# EAGLE schematic ECG_TRUE (EAGLE 9.4.1)
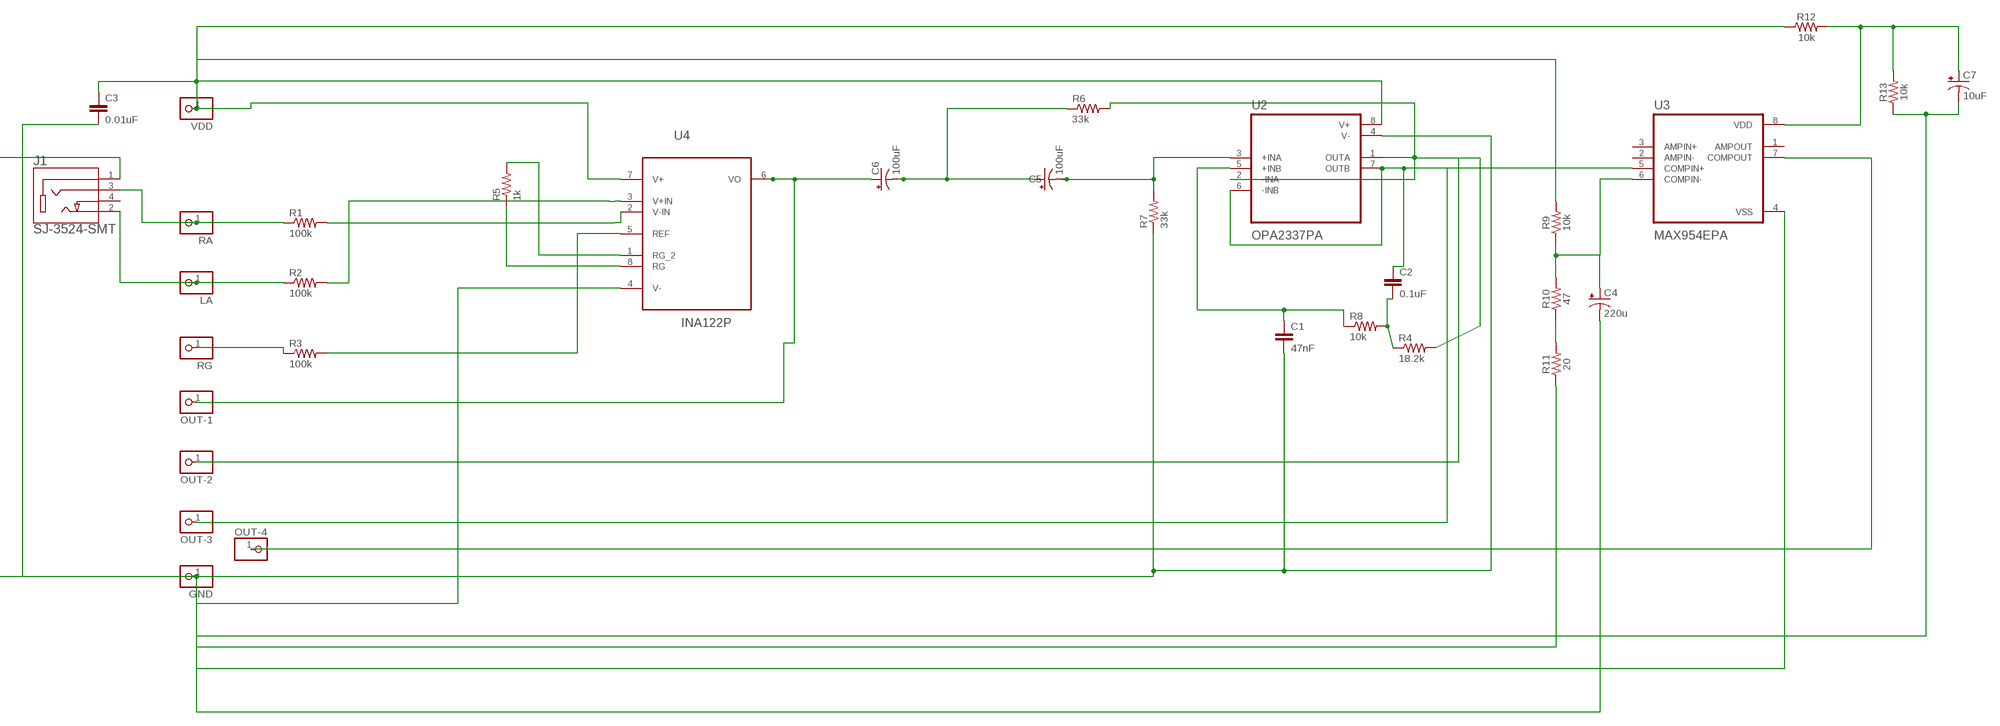
[diagram p0: schematic, sheet 1]

## Parts
C1  47nF  0.1UF-KIT-EZ-50V-20%  [CAP-PTH-SMALL-KIT]
C2  0.1uF  0.1UF-KIT-EZ-50V-20%  [CAP-PTH-SMALL-KIT]
C3  0.01uF  0.1UF-KIT-EZ-50V-20%  [CAP-PTH-SMALL-KIT]
C4  220u  CAPACITOR-PE3.5-10  [E3,5-10]
C5  100uF  100UF-POLAR-RADIAL-2.5MM-25V-20%  [CPOL-RADIAL-2.5MM-6.5MM]
C6  100uF  100UF-POLAR-RADIAL-2.5MM-25V-20%  [CPOL-RADIAL-2.5MM-6.5MM]
C7  10uF  10UF-POLAR-RADIAL-2.5MM-KIT-25V-20%  [CPOL-RADIAL-2.5MM-5MM-KIT]
GND  PINHD-1X1  [1X01]
J1  SJ-3524-SMT  [CUI_SJ-3524-SMT]
LA  PINHD-1X1  [1X01]
OUT-1  PINHD-1X1  [1X01]
OUT-2  PINHD-1X1  [1X01]
OUT-3  PINHD-1X1  [1X01]
OUT-4  PINHD-1X1  [1X01]
R1  100k  10KOHM-HORIZ_KIT-1/4W-1%  [AXIAL-0.3-KIT]
R2  100k  10KOHM-HORIZ_KIT-1/4W-1%  [AXIAL-0.3-KIT]
R3  100k  10KOHM-HORIZ_KIT-1/4W-1%  [AXIAL-0.3-KIT]
R4  18.2k  10KOHM-HORIZ_KIT-1/4W-1%  [AXIAL-0.3-KIT]
R5  1k  1KOHM-HORIZ_KIT-1/4W-1%  [AXIAL-0.3-KIT]
R6  33k  10KOHM-HORIZ_KIT-1/4W-1%  [AXIAL-0.3-KIT]
R7  33k  10KOHM-HORIZ_KIT-1/4W-1%  [AXIAL-0.3-KIT]
R8  10k  10KOHM-HORIZ_KIT-1/4W-1%  [AXIAL-0.3-KIT]
R9  10k  10KOHM-HORIZ_KIT-1/4W-1%  [AXIAL-0.3-KIT]
R10  47  10KOHM-HORIZ_KIT-1/4W-1%  [AXIAL-0.3-KIT]
R11  20  10KOHM-HORIZ_KIT-1/4W-1%  [AXIAL-0.3-KIT]
R12  10k  10KOHM-HORIZ-1/6W-5%  [AXIAL-0.3]
R13  10k  10KOHM-HORIZ-1/6W-5%  [AXIAL-0.3]
RA  PINHD-1X1  [1X01]
RG  PINHD-1X1  [1X01]
U2  OPA2337PA  [DIP794W45P254L1060H508Q8]
U3  MAX954EPA  [DIP794W47P254L991H457Q8]
U4  INA122P  [DIP254P762X508-8]
VDD  PINHD-1X1  [1X01]

## Nets
N$1: J1.3 R1.P$1 RA.1
N$2: C7.1(+) R12.P$2 R13.P$2 U3.8(VDD)
N$3: C2.2 R4.P$1 R8.P$2
N$4: R1.P$2 U4.2(V-IN)
N$6: R2.P$2 U4.3(V+IN)
N$7: R3.P$1 RG.1
N$8: R3.P$2 U4.5(REF)
N$9: C6.1(+) OUT-1.1 U4.6(VO)
N$10: R5.P$2 U4.1(RG_2)
N$11: R5.P$1 U4.8(RG)
N$12: C5.1(+) C6.2(-) R6.P$1
N$13: C5.2(-) R7.P$2 U2.3(+INA)
N$15: OUT-2.1 R4.P$2 R6.P$2 U2.1(OUTA) U2.2(-INA)
N$16: C3.1 R9.P$2 R12.P$1 U2.8(V+) U4.7(V+) VDD.1
N$17: C2.1 OUT-3.1 U2.6(-INB) U2.7(OUTB) U3.5(COMPIN+)
N$18: R10.P$1 R11.P$2
N$19: C1.1 R8.P$1 U2.5(+INB)
N$20: C4.+ R9.P$1 R10.P$2 U3.6(COMPIN-)
N$21: OUT-4.1 U3.7(COMPOUT)
N$22: J1.2 LA.1 R2.P$1
N$23: C1.2 C3.2 C4.- C7.2(-) GND.1 J1.1 R7.P$1 R11.P$1 R13.P$1 U2.4(V-) U3.4(VSS) U4.4(V-)
Unconnected: J1.4 U3.1(AMPOUT) U3.2(AMPIN-) U3.3(AMPIN+)

## Library data of the parts
C1 C3 = SparkFun-Capacitors:0.1UF: 0.1µF ceramic capacitors A capacitor is a passive two-terminal electrical component used to store electrical energy temporarily in an electric field.; PROD_ID: CAP-08370; VALUE: 0.1uF
C2 = SparkFun-Capacitors:0.1UF: 0.1µF ceramic capacitors A capacitor is a passive two-terminal electrical component used to store electrical energy temporarily in an electric field.; PROD_ID: CAP-08370
C4 = BeagleBone_Blue_R3:CAPACITOR-P: POLARIZED CAPACITOR, American symbol
C5 C6 = SparkFun-Capacitors:100UF-POLAR: 100µF polarized capacitors A capacitor is a passive two-terminal electrical component used to store electrical energy temporarily in an electric field.; PROD_ID: CAP-08439
C7 = SparkFun-Capacitors:10UF-POLAR: 10.0µF polarized capacitors A capacitor is a passive two-terminal electrical component used to store electrical energy temporarily in an electric field.; PROD_ID: CAP-08440
GND LA OUT-1-OUT-4 RA RG VDD = pinhead:PINHD-1X1: PIN HEADER
J1 = SJ-3524-SMT:SJ-3524-SMT: Audio Jack Connector 3.5 mm Low Profile Surface Mount Stereo Jack, 4 Pin Right-Angle; CUI_PURCHASE_URL: https://www.cui.com/product/interconnect/connectors/audio-connectors/jacks/sj-352x-smt-series?utm_source=snapeda.com&utm_medium=referral&utm_campaign=snapedaBOM; DESCRIPTION: 3.5 mm, Stereo, Right Angle, Surface Mount _SMT_, Audio Jack Connector; DIGI-KEY_PART_NUMBER: CP-3524SJCT-ND; DIGI-KEY_PURCHASE_URL: https://www.digikey.com/product-detail/en/cui-devices/SJ-3524-SMT-TR/CP-3524SJCT-ND/669705?utm_source=snapeda&utm_medium=aggregator&utm_campaign=symbol; MF: CUI Devices; MP: SJ-3524-SMT-TR; PACKAGE: None
R1-R4 R6 R7 R10 R11 = SparkFun-Resistors:10KOHM: 10kΩ resistor A resistor is a passive two-terminal electrical component that implements electrical resistance as a circuit element. Resistors act to reduce current flow, and, at the same time, act to lower voltage levels within circuits. - Wikipedia; PROD_ID: RES-12183; VALUE: 10k
R5 = SparkFun-Resistors:1KOHM: 1kΩ resistor A resistor is a passive two-terminal electrical component that implements electrical resistance as a circuit element. Resistors act to reduce current flow, and, at the same time, act to lower voltage levels within circuits. - Wikipedia; PROD_ID: RES-12182
R8 R9 = SparkFun-Resistors:10KOHM: 10kΩ resistor A resistor is a passive two-terminal electrical component that implements electrical resistance as a circuit element. Resistors act to reduce current flow, and, at the same time, act to lower voltage levels within circuits. - Wikipedia; PROD_ID: RES-12183
R12 R13 = SparkFun-Resistors:10KOHM: 10kΩ resistor A resistor is a passive two-terminal electrical component that implements electrical resistance as a circuit element. Resistors act to reduce current flow, and, at the same time, act to lower voltage levels within circuits. - Wikipedia; PROD_ID: RES-08375
U2 = OPA2337PA:OPA2337PA: None; AVAILABILITY: Unavailable; DESCRIPTION: MicroSIZE, Single-Supply CMOS Operational Amplifier MicroAmplifier Series 8-PDIP; MF: Texas Instruments; MP: OPA2337PA; PACKAGE: DIP-8 Texas Instruments; PRICE: None
U3 = MAX954EPA:MAX954EPA; DESCRIPTION: Op Amp Comparator and Reference 8-Pin PDIP N; DIGI-KEY_PART_NUMBER: MAX954EPA+-ND; DIGI-KEY_PURCHASE_URL: https://www.digikey.com/product-detail/en/maxim-integrated/MAX954EPA-/MAX954EPA--ND/1495015?utm_source=snapeda&utm_medium=aggregator&utm_campaign=symbol; MF: Maxim Integrated; MP: MAX954EPA+; PACKAGE: PDIP-8 Maxim
U4 = INA122P:INA122P: INSTRUMENTATION AMPLIFIER; DESCRIPTION: SP Amp INSTR Amp Single R-R O/P ±18V/36V 8-Pin PDIP Tube; DIGI-KEY_PART_NUMBER: INA122P-ND; DIGI-KEY_PURCHASE_URL: https://www.digikey.com/product-detail/en/texas-instruments/INA122P/INA122P-ND/266168?utm_source=snapeda&utm_medium=aggregator&utm_campaign=symbol; MF: Texas Instruments; MP: INA122P; PACKAGE: PDIP-8 Burr Brown